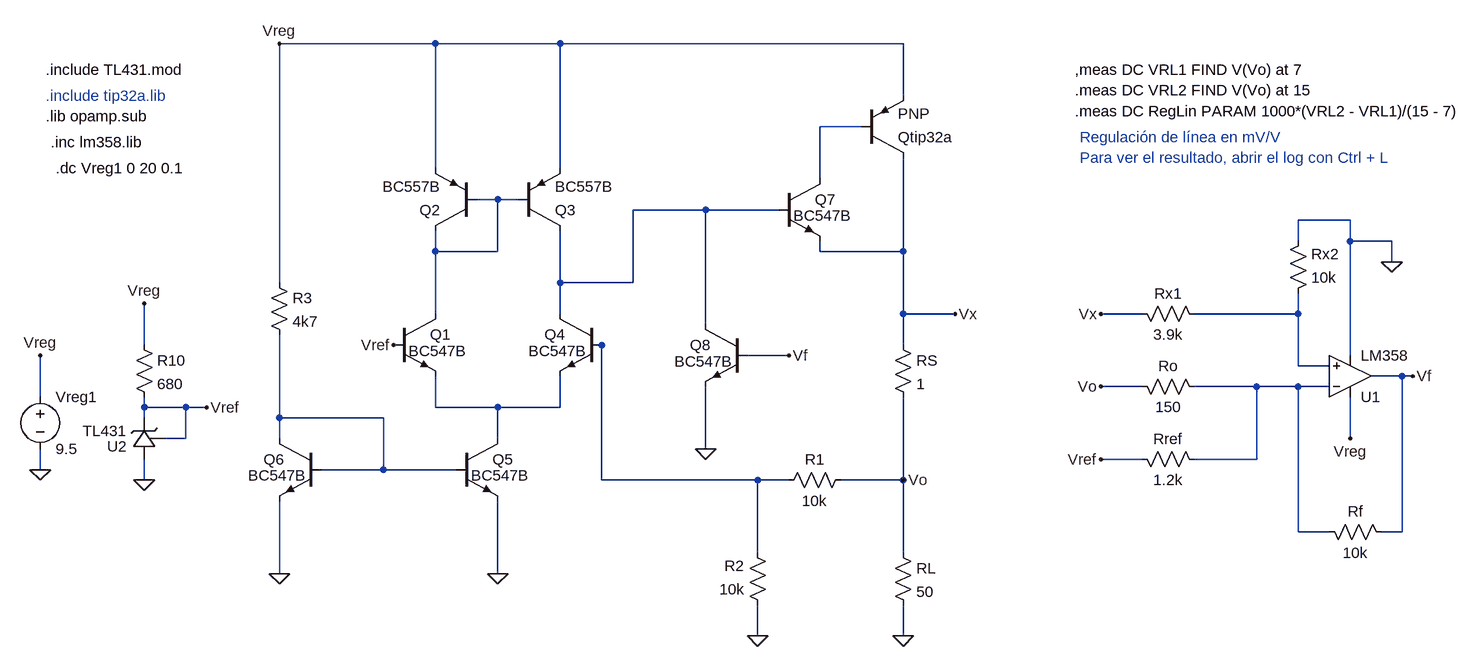
[diagram p0: schematic Regulacion de Linea.asc]
Regulacion de Linea.asc, the LTspice schematic file:
Version 4
SHEET 1 1456 712
WIRE -176 -240 -416 -240
WIRE 16 -240 -176 -240
WIRE 544 -240 16 -240
WIRE 544 -160 544 -240
WIRE 480 -112 416 -112
WIRE -176 -48 -176 -240
WIRE 16 -48 16 -240
WIRE 416 -32 416 -112
WIRE -80 0 -112 0
WIRE -48 0 -80 0
WIRE 240 16 128 16
WIRE 352 16 240 16
WIRE 1232 32 1152 32
WIRE 1152 64 1152 32
WIRE 1232 64 1232 32
WIRE 1296 64 1232 64
WIRE -176 80 -176 48
WIRE -80 80 -80 0
WIRE -80 80 -176 80
WIRE 416 80 416 64
WIRE 544 80 544 -64
WIRE 544 80 416 80
WIRE 1296 96 1296 64
WIRE -416 128 -416 -240
WIRE 16 128 16 48
WIRE 128 128 128 16
WIRE 128 128 16 128
WIRE -176 176 -176 80
WIRE 16 176 16 128
WIRE 544 176 544 80
WIRE 624 176 544 176
WIRE 912 176 848 176
WIRE 1152 176 1152 144
WIRE 1152 176 992 176
WIRE 240 192 240 16
WIRE -624 224 -624 160
WIRE 80 224 64 224
WIRE 544 224 544 176
WIRE 368 240 304 240
WIRE 1232 240 1232 64
WIRE 1152 256 1152 176
WIRE 1200 256 1152 256
WIRE 1312 272 1264 272
WIRE 1328 272 1312 272
WIRE 912 288 848 288
WIRE 1088 288 992 288
WIRE 1152 288 1088 288
WIRE 1200 288 1152 288
WIRE -784 304 -784 240
WIRE -624 320 -624 304
WIRE -560 320 -624 320
WIRE -528 320 -560 320
WIRE -176 320 -176 272
WIRE -80 320 -176 320
WIRE 16 320 16 272
WIRE 16 320 -80 320
WIRE -624 336 -624 320
WIRE -416 336 -416 208
WIRE -256 336 -416 336
WIRE -560 368 -560 320
WIRE -560 368 -592 368
WIRE -416 368 -416 336
WIRE -80 368 -80 320
WIRE 1232 368 1232 304
WIRE 240 384 240 288
WIRE 912 400 848 400
WIRE 1088 400 1088 288
WIRE 1088 400 992 400
WIRE -784 416 -784 384
WIRE -256 416 -256 336
WIRE -256 416 -352 416
WIRE -144 416 -256 416
WIRE -624 432 -624 400
WIRE 80 432 80 224
WIRE 320 432 80 432
WIRE 368 432 320 432
WIRE 544 432 544 304
WIRE 544 432 448 432
WIRE 1152 512 1152 288
WIRE 1200 512 1152 512
WIRE 1312 512 1312 272
WIRE 1312 512 1280 512
WIRE 320 544 320 432
WIRE 544 544 544 432
WIRE -416 576 -416 464
WIRE -80 576 -80 464
WIRE 320 672 320 624
WIRE 544 672 544 624
FLAG -80 576 0
FLAG -416 576 0
FLAG 544 672 0
FLAG 320 672 0
FLAG -240 224 Vref
FLAG -784 416 0
FLAG -784 240 Vreg
FLAG -416 -240 Vreg
FLAG 544 432 Vo
FLAG 624 176 Vx
FLAG 240 384 0
FLAG 368 240 Vf
FLAG 1328 272 Vf
FLAG 848 400 Vref
FLAG 848 288 Vo
FLAG 848 176 Vx
FLAG 1232 368 Vreg
FLAG -624 432 0
FLAG -528 320 Vref
FLAG -624 160 Vreg
FLAG 1296 96 0
SYMBOL npn -240 176 R0
WINDOW 3 23 57 Left 2
SYMATTR Value BC547B
SYMATTR InstName Q1
SYMBOL pnp -112 48 R180
SYMATTR InstName Q2
SYMATTR Value BC557B
SYMBOL res 464 416 R90
WINDOW 0 0 56 VBottom 2
WINDOW 3 32 56 VTop 2
SYMATTR InstName R1
SYMATTR Value 10k
SYMBOL res 336 640 R180
WINDOW 0 36 76 Left 2
WINDOW 3 36 40 Left 2
SYMATTR InstName R2
SYMATTR Value 10k
SYMBOL res -432 112 R0
SYMATTR InstName R3
SYMATTR Value 4k7
SYMBOL voltage -784 288 R0
WINDOW 123 0 0 Left 0
WINDOW 39 0 0 Left 0
SYMATTR InstName Vreg1
SYMATTR Value 9.5
SYMBOL res 528 528 R0
SYMATTR InstName RL
SYMATTR Value 50
SYMBOL pnp 480 -64 M180
SYMATTR InstName Qtip32a
SYMBOL res 528 208 R0
SYMATTR InstName RS
SYMATTR Value 1
SYMBOL res 1296 528 M270
WINDOW 0 32 56 VTop 2
WINDOW 3 0 56 VBottom 2
SYMATTR InstName Rf
SYMATTR Value 10k
SYMBOL res 1008 416 M270
WINDOW 0 32 56 VTop 2
WINDOW 3 0 56 VBottom 2
SYMATTR InstName Rref
SYMATTR Value 1.2k
SYMBOL res 1008 304 M270
WINDOW 0 32 56 VTop 2
WINDOW 3 0 56 VBottom 2
SYMATTR InstName Ro
SYMATTR Value 150
SYMBOL res 1008 192 M270
WINDOW 0 32 56 VTop 2
WINDOW 3 0 56 VBottom 2
SYMATTR InstName Rx1
SYMATTR Value 3.9k
SYMBOL res 1136 160 M180
WINDOW 0 36 76 Left 2
WINDOW 3 36 40 Left 2
SYMATTR InstName Rx2
SYMATTR Value 10k
SYMBOL OpAmps\\opamp2 1232 336 M180
SYMATTR InstName U1
SYMATTR Value LM358
SYMBOL pnp -48 48 M180
SYMATTR InstName Q3
SYMATTR Value BC557B
SYMBOL npn 80 176 M0
WINDOW 3 23 57 Left 2
SYMATTR Value BC547B
SYMATTR InstName Q4
SYMBOL npn -144 368 R0
WINDOW 3 23 57 Left 2
SYMATTR Value BC547B
SYMATTR InstName Q5
SYMBOL npn -352 368 M0
WINDOW 3 23 57 Left 2
SYMATTR Value BC547B
SYMATTR InstName Q6
SYMBOL npn 352 -32 R0
WINDOW 3 23 57 Left 2
SYMATTR Value BC547B
SYMATTR InstName Q7
SYMBOL npn 304 192 M0
WINDOW 3 23 57 Left 2
SYMATTR Value BC547B
SYMATTR InstName Q8
SYMBOL res -640 208 R0
SYMATTR InstName R10
SYMATTR Value 680
SYMBOL TL431 -608 400 R180
SYMATTR InstName U2
TEXT -776 -160 Left 2 ;.include tip32a.lib
TEXT -776 -128 Left 2 !.lib opamp.sub
TEXT -776 -200 Left 2 !.include TL431.mod
TEXT -768 -88 Left 2 !.inc lm358.lib
TEXT -760 -48 Left 2 !.dc Vreg1 0 20 0.1
TEXT 808 -200 Left 2 !,meas DC VRL1 FIND V(Vo) at 7
TEXT 808 -168 Left 2 !.meas DC VRL2 FIND V(Vo) at 15
TEXT 808 -136 Left 2 !.meas DC RegLin PARAM 1000*(VRL2 - VRL1)/(15 - 7)
TEXT 816 -96 Left 2 ;Regulación de línea en mV/V\nPara ver el resultado, abrir el log con Ctrl + L

The netlist it stands for:
* Regulacion de Linea.asc
Q1 N002 Vref N007 0 BC547B
Q2 N002 N002 Vreg 0 BC557B
R1 Vo N005 10k
R2 0 N005 10k
R3 Vreg N008 4k7
Vreg1 Vreg 0 9.5
RL Vo 0 50
Qtip32a Vx N001 Vreg 0 PNP
RS Vx Vo 1
Rf Vf N006 10k
Rref N006 Vref 1.2k
Ro N006 Vo 150
Rx1 N004 Vx 3.9k
Rx2 N004 0 10k
XU1 N004 N006 Vreg 0 Vf LM358  ; pins In+ In- V+ V- OUT
Q3 N003 N002 Vreg 0 BC557B
Q4 N003 N005 N007 0 BC547B
Q5 N007 N008 0 0 BC547B
Q6 N008 N008 0 0 BC547B
Q7 N001 N003 Vx 0 BC547B
Q8 N003 Vf 0 0 BC547B
R10 Vreg Vref 680
XU2 0 Vref Vref TL431 TL431 TL431  ; pins A K ref
.model NPN NPN
.model PNP PNP
.lib standard.bjt
* .include tip32a.lib
.lib opamp.sub
.include TL431.mod
.inc lm358.lib
.dc Vreg1 0 20 0.1
,meas DC VRL1 FIND V(Vo) at 7
.meas DC VRL2 FIND V(Vo) at 15
.meas DC RegLin PARAM 1000*(VRL2 - VRL1)/(15 - 7)
* Regulación de línea en mV/V
* Para ver el resultado, abrir el log con Ctrl + L
.lib TL431.mod
.backanno
.end